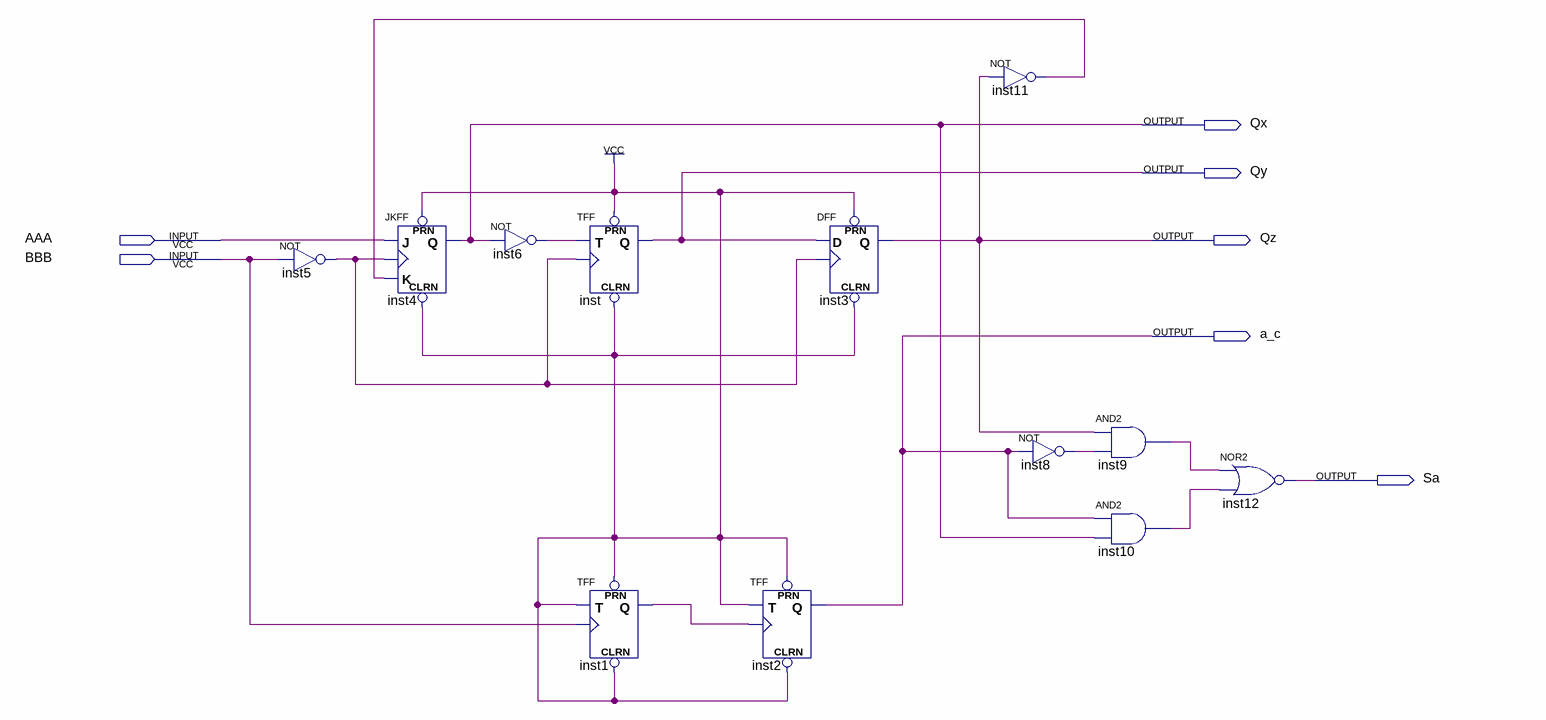
[diagram p0: schematic sheet]
// Quartus schematic LAB1.bdf as structural Verilog: 12 symbols, 7 pins
module LAB1 (
  input  AAA,
  input  BBB,
  output Qx,
  output Qy,
  output Qz,
  output a_c,
  output Sa
);

  wire inst1_q, inst5_out, inst6_out, inst8_out, inst9_out, inst10_out, inst11_out;

  not inst5 (inst5_out, BBB);
  JKFF inst4 (.PRN(1'b1), .CLRN(1'b1), .K(inst11_out), .J(AAA), .CLK(inst5_out), .Q(Qx));
  not inst6 (inst6_out, Qx);
  TFF inst (.PRN(1'b1), .CLRN(1'b1), .T(inst6_out), .CLK(inst5_out), .Q(Qy));
  TFF inst1 (.PRN(1'b1), .CLRN(1'b1), .T(1'b1), .CLK(BBB), .Q(inst1_q));
  DFF inst3 (.CLRN(1'b1), .CLK(inst5_out), .D(Qy), .PRN(1'b1), .Q(Qz));
  TFF inst2 (.PRN(1'b1), .CLRN(1'b1), .T(1'b1), .CLK(inst1_q), .Q(a_c));
  not inst11 (inst11_out, Qz);
  not inst8 (inst8_out, a_c);
  and inst9 (inst9_out, Qz, inst8_out);
  and inst10 (inst10_out, a_c, Qx);
  nor inst12 (Sa, inst9_out, inst10_out);
endmodule
